# EAGLE schematic scout_schematics_v0 (EAGLE 7.1.0)
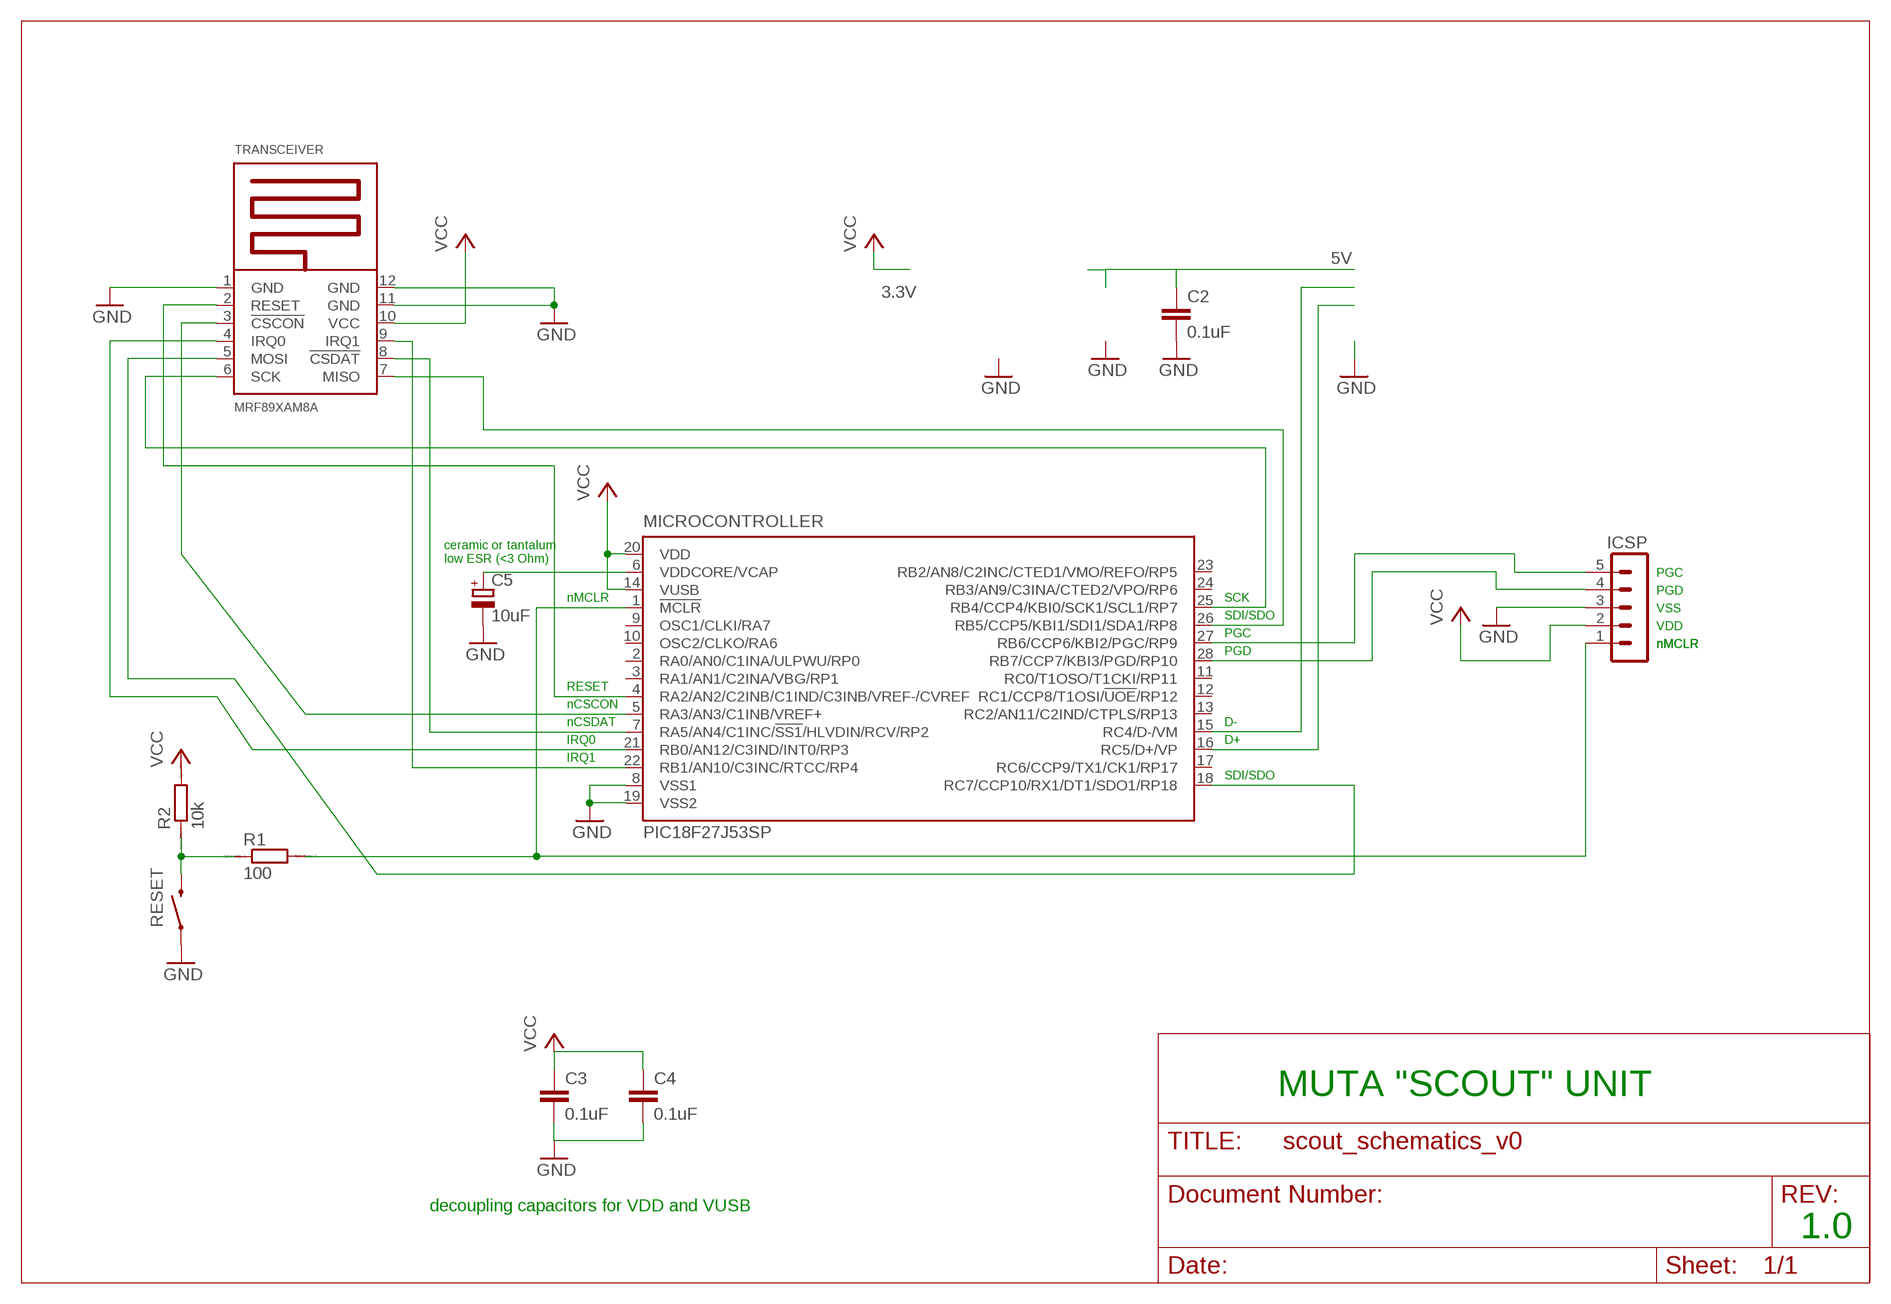
[diagram p0: schematic, sheet 1]

## Parts
C2  0.1uF  C-EU050-025X075  [C050-025X075]
C3  0.1uF  C-EU050-025X075  [C050-025X075]
C4  0.1uF  C-EU050-025X075  [C050-025X075]
C5  10uF  CPOL-EUC/6032-28R  [C/6032-28R]
ICSP  MA05-1  [MA05-1]
MICROCONTROLLER  PIC18F27J53SP  [DIL28-3]
R1  100  R-EU_0207_10  [0207/10]
R2  10k  R-EU_0207_10  [0207/10]
RESET  SWITCH-MOMENTARY-2SMD-4  [TACTILE_SWITCH_TALL]
TRANSCEIVER  MRF89XAM8A  [MRF89XAMXA]

## Nets
5V: C2.1
GND: C2.2 C3.2 C4.2 C5.- ICSP.3 MICROCONTROLLER.8(VSS1) MICROCONTROLLER.19(VSS2) RESET.A2 TRANSCEIVER.1(GND) TRANSCEIVER.11(GND) TRANSCEIVER.12(GND)
N$1: MICROCONTROLLER.15(RC4/D-/VM)
N$2: MICROCONTROLLER.16(RC5/D+/VP)
N$3: ICSP.1 MICROCONTROLLER.1(!MCLR) R1.2
N$4: C5.+ MICROCONTROLLER.6(VDDCORE/VCAP)
N$5: R1.1 R2.1 RESET.B2
N$6: ICSP.4 MICROCONTROLLER.28(RB7/CCP7/KBI3/PGD/RP10)
N$7: ICSP.5 MICROCONTROLLER.27(RB6/CCP6/KBI2/PGC/RP9)
N$8: MICROCONTROLLER.21(RB0/AN12/C3IND/INT0/RP3) TRANSCEIVER.4(IRQ0)
N$9: MICROCONTROLLER.26(RB5/CCP5/KBI1/SDI1/SDA1/RP8) TRANSCEIVER.7(MISO)
N$10: MICROCONTROLLER.25(RB4/CCP4/KBI0/SCK1/SCL1/RP7) TRANSCEIVER.6(SCK)
N$11: MICROCONTROLLER.5(RA3/AN3/C1INB/VREF+) TRANSCEIVER.3(!CSCON)
N$12: MICROCONTROLLER.7(RA5/AN4/C1INC/!SS1!/HLVDIN/RCV/RP2) TRANSCEIVER.8(!CSDAT)
N$13: MICROCONTROLLER.4(RA2/AN2/C2INB/C1IND/C3INB/VREF-/CVREF) TRANSCEIVER.2(RESET)
N$16: MICROCONTROLLER.22(RB1/AN10/C3INC/RTCC/RP4) TRANSCEIVER.9(IRQ1)
N$17: MICROCONTROLLER.18(RC7/CCP10/RX1/DT1/SDO1/RP18) TRANSCEIVER.5(MOSI)
VCC: C3.1 C4.1 ICSP.2 MICROCONTROLLER.14(VUSB) MICROCONTROLLER.20(VDD) R2.2 TRANSCEIVER.10(VCC)
Unconnected: MICROCONTROLLER.2(RA0/AN0/C1INA/ULPWU/RP0) MICROCONTROLLER.3(RA1/AN1/C2INA/VBG/RP1) MICROCONTROLLER.9(OSC1/CLKI/RA7) MICROCONTROLLER.10(OSC2/CLKO/RA6) MICROCONTROLLER.11(RC0/T1OSO/T1CKI/RP11) MICROCONTROLLER.12(RC1/CCP8/T1OSI/!UOE!/RP12) MICROCONTROLLER.13(RC2/AN11/C2IND/CTPLS/RP13) MICROCONTROLLER.17(RC6/CCP9/TX1/CK1/RP17) MICROCONTROLLER.23(RB2/AN8/C2INC/CTED1/VMO/REFO/RP5) MICROCONTROLLER.24(RB3/AN9/C3INA/CTED2/VPO/RP6)

## Notes on the sheet
- ceramic or tantalum
  low ESR (<3 Ohm)
- PGC
- PGD
- nMCLR | SCK
- VSS
- SDI/SDO
- VDD
- PGC
- nMCLR | nMCLR
- PGD
- RESET
- nCSCON
- nCSDAT | D-
- IRQ0 | D+
- IRQ1
- SDI/SDO
- MUTA "SCOUT" UNIT
- decoupling capacitors for VDD and VUSB
- 1.0

## Library data of the parts
C2-C4 = rcl:C-EU: CAPACITOR, European symbol
C5 = resistor:CPOL-EU: POLARIZED CAPACITOR, European symbol
ICSP = con-lstb:MA05-1: PIN HEADER; OC_FARNELL: unknown; OC_NEWARK: unknown
MICROCONTROLLER = microchip:PIC18F2*J53: PIC18F47J53 Family High-Performance USB Microcontrollers with nanoWatt XLP Technology Source: Data sheet <http://ww1.microchip.com/downloads/en/DeviceDoc/39964B.pdf>; MPN: PIC18F27J53-I/SP; OC_FARNELL: unknown; OC_NEWARK: 63R7839
R1 R2 = resistor:R-EU_: RESISTOR, European symbol; SPICEPREFIX: R
RESET = SparkFun-Electromechanical:SWITCH-MOMENTARY-2: Various NO switches- pushbuttons, reed, etc; PROD_ID: SWCH-11966
TRANSCEIVER = microchip2:MRF89XAM8A: Microchip MRF89XAM8A 868MHz Module